# Altium schematic sheet BOWIE_CONNECTORS.SchDoc
size A; SheetNumber: 1; SheetTotal: 8
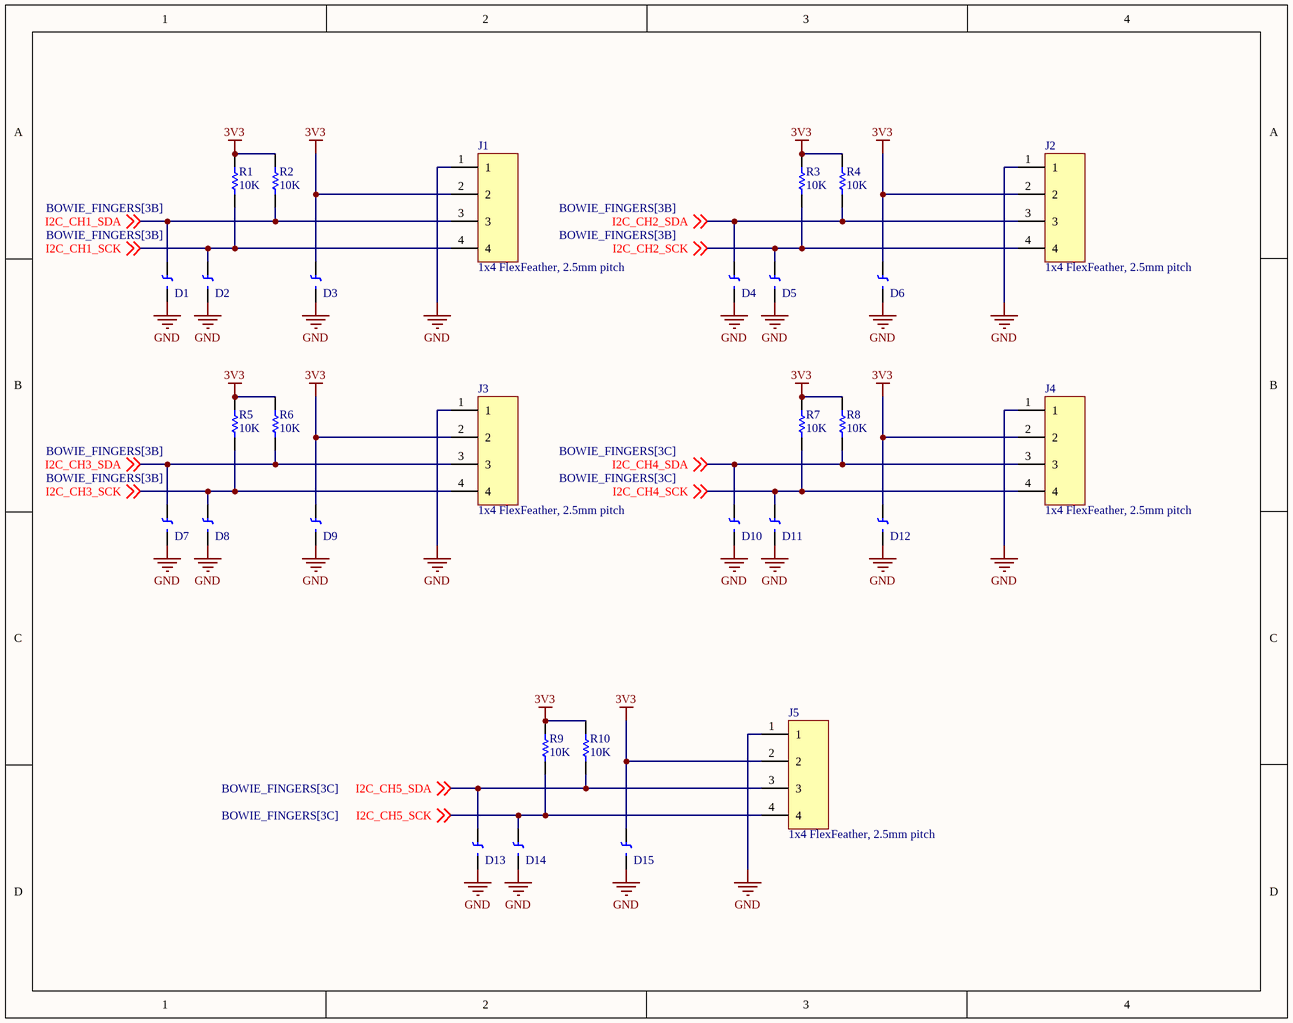
[diagram p0: BOWIE_CONNECTORS.SchDoc]

## Parts
D1  TI_ESD351DPYR  [FP-DPY0002A-MFG]  (value not drawn)
D2  TI_ESD351DPYR  [FP-DPY0002A-MFG]  (value not drawn)
D3  TI_ESD351DPYR  [FP-DPY0002A-MFG]  (value not drawn)
D4  TI_ESD351DPYR  [FP-DPY0002A-MFG]  (value not drawn)
D5  TI_ESD351DPYR  [FP-DPY0002A-MFG]  (value not drawn)
D6  TI_ESD351DPYR  [FP-DPY0002A-MFG]  (value not drawn)
D7  TI_ESD351DPYR  [FP-DPY0002A-MFG]  (value not drawn)
D8  TI_ESD351DPYR  [FP-DPY0002A-MFG]  (value not drawn)
D9  TI_ESD351DPYR  [FP-DPY0002A-MFG]  (value not drawn)
D10  TI_ESD351DPYR  [FP-DPY0002A-MFG]  (value not drawn)
D11  TI_ESD351DPYR  [FP-DPY0002A-MFG]  (value not drawn)
D12  TI_ESD351DPYR  [FP-DPY0002A-MFG]  (value not drawn)
D13  TI_ESD351DPYR  [FP-DPY0002A-MFG]  (value not drawn)
D14  TI_ESD351DPYR  [FP-DPY0002A-MFG]  (value not drawn)
D15  TI_ESD351DPYR  [FP-DPY0002A-MFG]  (value not drawn)
J1  1x4 FlexFeather, 2.5mm pitch  [FlexFeather_2.5mm_5mm_4pos]
J2  1x4 FlexFeather, 2.5mm pitch  [FlexFeather_2.5mm_5mm_4pos]
J3  1x4 FlexFeather, 2.5mm pitch  [FlexFeather_2.5mm_5mm_4pos]
J4  1x4 FlexFeather, 2.5mm pitch  [FlexFeather_2.5mm_5mm_4pos]
J5  1x4 FlexFeather, 2.5mm pitch  [FlexFeather_2.5mm_5mm_4pos]
R1  10K  [RESC1005X40X25NL05T05]
R2  10K  [RESC1005X40X25NL05T05]
R3  10K  [RESC1005X40X25NL05T05]
R4  10K  [RESC1005X40X25NL05T05]
R5  10K  [RESC1005X40X25NL05T05]
R6  10K  [RESC1005X40X25NL05T05]
R7  10K  [RESC1005X40X25NL05T05]
R8  10K  [RESC1005X40X25NL05T05]
R9  10K  [RESC1005X40X25NL05T05]
R10  10K  [RESC1005X40X25NL05T05]

## Nets
3V3: D3.2(Cathode) D6.2(Cathode) D9.2(Cathode) D12.2(Cathode) D15.2(Cathode) J1.2 J2.2 J3.2 J4.2 J5.2 R1.2 R2.2 R3.2 R4.2 R5.2 R6.2 R7.2 R8.2 R9.2 R10.2
GND: D1.1(Anode) D2.1(Anode) D3.1(Anode) D4.1(Anode) D5.1(Anode) D6.1(Anode) D7.1(Anode) D8.1(Anode) D9.1(Anode) D10.1(Anode) D11.1(Anode) D12.1(Anode) D13.1(Anode) D14.1(Anode) D15.1(Anode) J1.1 J2.1 J3.1 J4.1 J5.1
I2C_CH1_SCK: D2.2(Cathode) J1.4 R1.1 ; off-sheet I2C_CH1_SCK
I2C_CH1_SDA: D1.2(Cathode) J1.3 R2.1 ; off-sheet I2C_CH1_SDA
I2C_CH2_SCK: D5.2(Cathode) J2.4 R3.1 ; off-sheet I2C_CH2_SCK
I2C_CH2_SDA: D4.2(Cathode) J2.3 R4.1 ; off-sheet I2C_CH2_SDA
I2C_CH3_SCK: D8.2(Cathode) J3.4 R5.1 ; off-sheet I2C_CH3_SCK
I2C_CH3_SDA: D7.2(Cathode) J3.3 R6.1 ; off-sheet I2C_CH3_SDA
I2C_CH4_SCK: D11.2(Cathode) J4.4 R7.1 ; off-sheet I2C_CH4_SCK
I2C_CH4_SDA: D10.2(Cathode) J4.3 R8.1 ; off-sheet I2C_CH4_SDA
I2C_CH5_SCK: D14.2(Cathode) J5.4 R9.1 ; off-sheet I2C_CH5_SCK
I2C_CH5_SDA: D13.2(Cathode) J5.3 R10.1 ; off-sheet I2C_CH5_SDA

## Library data of the parts
D1-D15 = Diode_300mil_Zener: DIODE, TVS, UNIDIR, 3.6VRWM, 4.5VBR, 6.5VCL, 16A, 1.8PF, X1SON-2; Manufacturer: Texas Instruments; Diode Type: Unidirectional; Voltage - Breakdown (Min): 4.5V; Unidirectional Channels: 1; Capacitance @ Frequency: 1.8pF @ 1MHz; Voltage - Reverse Standoff (Typ): 3.6V; Voltage - Clamping (Max) @ Ipp: 6.5V; Power - Peak Pulse: 36W; Series: ESD351; Applications: General Purpose; Max Operating Temperature: 125°C; Current - Peak Pulse (10/1000µs): 16A; Category: TVS - Diodes; RoHS: Yes; Min Operating Temperature: -40°C; Supplier Part Number 1: 296-51109-1-ND; Mounting Type: Surface Mount; Manufacturer Part Number: ESD351DPYR; Supplier 1: Digikey; Case/Package: 2-X1SON (1x.60)
J1-J5 = FlexFeather_2.5mm_5mm_4pos: 2.5mm pitch, 5mm long, 4 pos recommended layout to connect flexpcb to e-textile with ultrasonic bonding; Internal Part Number: XXX-XXXXX-XX; System: connector; Positions: 4; Manufacturer: *; Manufacturer Part Number: *; Supplier 1: *; Supplier Part Number 1: *; ComponentLink1Description: Datasheet; ComponentLink1URL: *; Pitch: 2.5mm; Length: 5; Category: Connectors
R1-R10 = CMP-1011-00510-4: Chip Resistor, 1 KOhm, +/- 1%, 100 mW, -55 to 155 degC, 0402 (1005 Metric), RoHS, Tape and Reel; PartNumber: ERJ-2RKF1001X; Manufacturer: Basic Passives; Voltage Rating: 50 V; Case\/Package: 0402; Resistance: 1 KOhm; Power Rating: 100 mW; DatasheetVersion: 04/2015; Radiation Hardening: No; Pins: 2; Height: 0.35 mm; RoHSCompliant: true; Case Code (Imperial): 0402; ComponentLink2Description: Datasheet; ComponentLink1Description: Manufacturer URL; PackageReference: 0402; Mount: Surface Mount; Package Quantity: 10000; Tolerance: 1%; ComponentLink1URL: http://www.panasonic.com/; PackageDescription: 2-Pin Surface Mount Device, Body 1 x 0.5 mm; Mounting Technology: Surface Mount; Case Code (Metric): 1005; ComponentLink2URL: http://industrial.panasonic.com/cdbs/www-data/pdf/RDA0000/AOA0000C86.pdf; REACH SVHC: Yes; Packaging: Tape and Reel; Max Operating Temperature: 155 degC; Min Operating Temperature: -55 degC; Width: 0.5 mm; Length: 1 mm